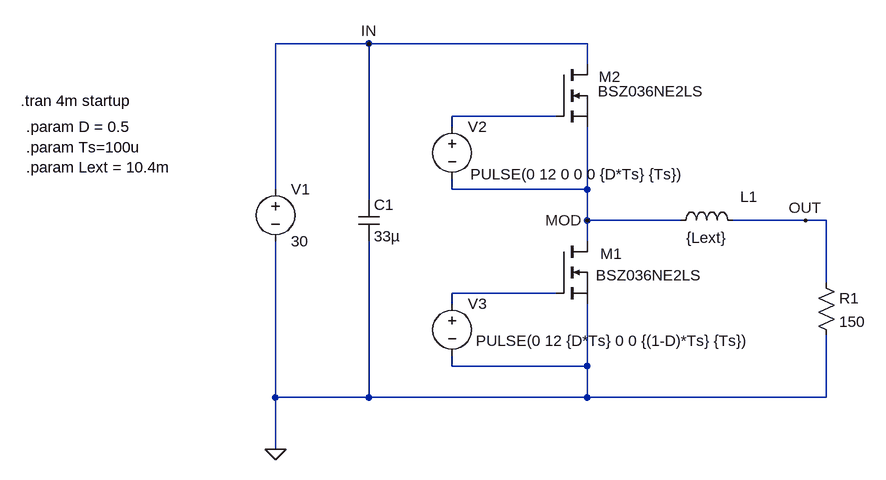
[diagram p0: schematic EMVSem_HB_Task1_Aufbau.asc]
EMVSem_HB_Task1_Aufbau.asc, the LTspice schematic file:
Version 4
SHEET 1 916 680
WIRE -80 -160 -224 -160
WIRE 256 -160 -80 -160
WIRE 256 -128 256 -160
WIRE 208 -48 48 -48
WIRE 48 -32 48 -48
WIRE -224 64 -224 -160
WIRE 48 64 48 48
WIRE 256 64 256 -32
WIRE 256 64 48 64
WIRE -80 80 -80 -160
WIRE 256 112 256 64
WIRE 400 112 256 112
WIRE 592 112 480 112
WIRE 624 112 592 112
WIRE 256 144 256 112
WIRE 624 208 624 112
WIRE 208 224 48 224
WIRE 48 240 48 224
WIRE 48 336 48 320
WIRE 256 336 256 240
WIRE 256 336 48 336
WIRE -224 384 -224 144
WIRE -80 384 -80 144
WIRE -80 384 -224 384
WIRE 256 384 256 336
WIRE 256 384 -80 384
WIRE 624 384 624 288
WIRE 624 384 256 384
WIRE -224 464 -224 384
FLAG -224 464 0
FLAG -80 -160 IN
FLAG 592 112 OUT
FLAG 256 112 MOD
SYMBOL voltage -224 48 R0
WINDOW 123 0 0 Left 2
WINDOW 39 0 0 Left 2
SYMATTR InstName V1
SYMATTR Value 30
SYMBOL voltage 48 -48 R0
WINDOW 123 0 0 Left 2
WINDOW 39 0 0 Left 2
WINDOW 3 28 89 Left 2
SYMATTR Value PULSE(0 12 0 0 0 {D*Ts} {Ts})
SYMATTR InstName V2
SYMBOL nmos 208 -128 R0
WINDOW 0 66 19 Left 2
WINDOW 3 64 41 Left 2
SYMATTR InstName M2
SYMATTR Value BSZ036NE2LS
SYMBOL ind 384 128 R270
WINDOW 0 37 121 VTop 2
WINDOW 3 5 56 VBottom 2
SYMATTR InstName L1
SYMATTR Value {Lext}
SYMBOL res 608 192 R0
SYMATTR InstName R1
SYMATTR Value 150
SYMBOL nmos 208 144 R0
WINDOW 0 68 19 Left 2
WINDOW 3 61 52 Left 2
SYMATTR InstName M1
SYMATTR Value BSZ036NE2LS
SYMBOL voltage 48 224 R0
WINDOW 123 0 0 Left 2
WINDOW 39 0 0 Left 2
WINDOW 3 37 73 Left 2
SYMATTR Value PULSE(0 12 {D*Ts} 0 0 {(1-D)*Ts} {Ts})
SYMATTR InstName V3
SYMBOL cap -96 80 R0
SYMATTR InstName C1
SYMATTR Value 33µ
TEXT -616 -72 Left 2 !.tran 4m startup
TEXT -608 -32 Left 2 !.param D = 0.5\n.param Ts=100u\n.param Lext = 10.4m

The netlist it stands for:
* EMVSem_HB_Task1_Aufbau.asc
V1 IN 0 30
V2 N001 MOD PULSE(0 12 0 0 0 {D*Ts} {Ts})
M2 IN N001 MOD MOD BSZ036NE2LS
L1 MOD OUT {Lext}
R1 OUT 0 150
M1 MOD N002 0 0 BSZ036NE2LS
V3 N002 0 PULSE(0 12 {D*Ts} 0 0 {(1-D)*Ts} {Ts})
C1 IN 0 33µ
.model NMOS NMOS
.model PMOS PMOS
.lib standard.mos
.tran 4m startup
.param D = 0.5
.param Ts=100u
.param Lext = 10.4m
.backanno
.end

* Results of the author's LTspice run, read from the files saved beside the schematic
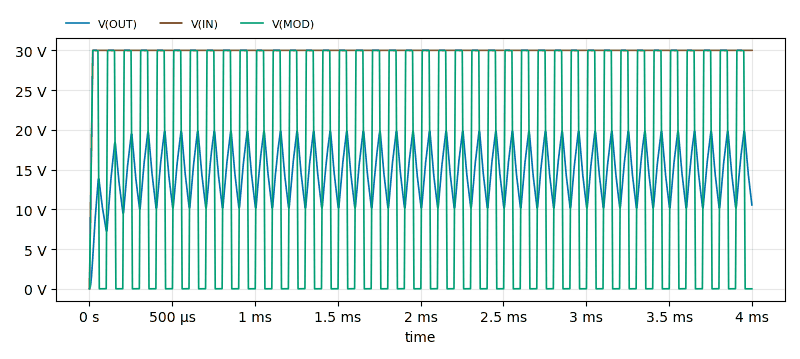
[diagram p1: Transient Analysis of EMVSem_HB_Task1_Aufbau.asc, plotted from the saved traces]
* Transient Analysis, 1 run:
*   V(OUT): min 0 V, max 19.83 V, average 14.78 V, rms 15.19 V, last 10.55 V
*   V(IN): min 0 V, max 30 V, average 29.93 V, rms 29.95 V, last 30 V
*   V(MOD): min -383 µV, max 30 V, average 14.96 V, rms 20.64 V, last -211.5 µV